# EAGLE design ZATINO V2 (EAGLE 9.6.2)
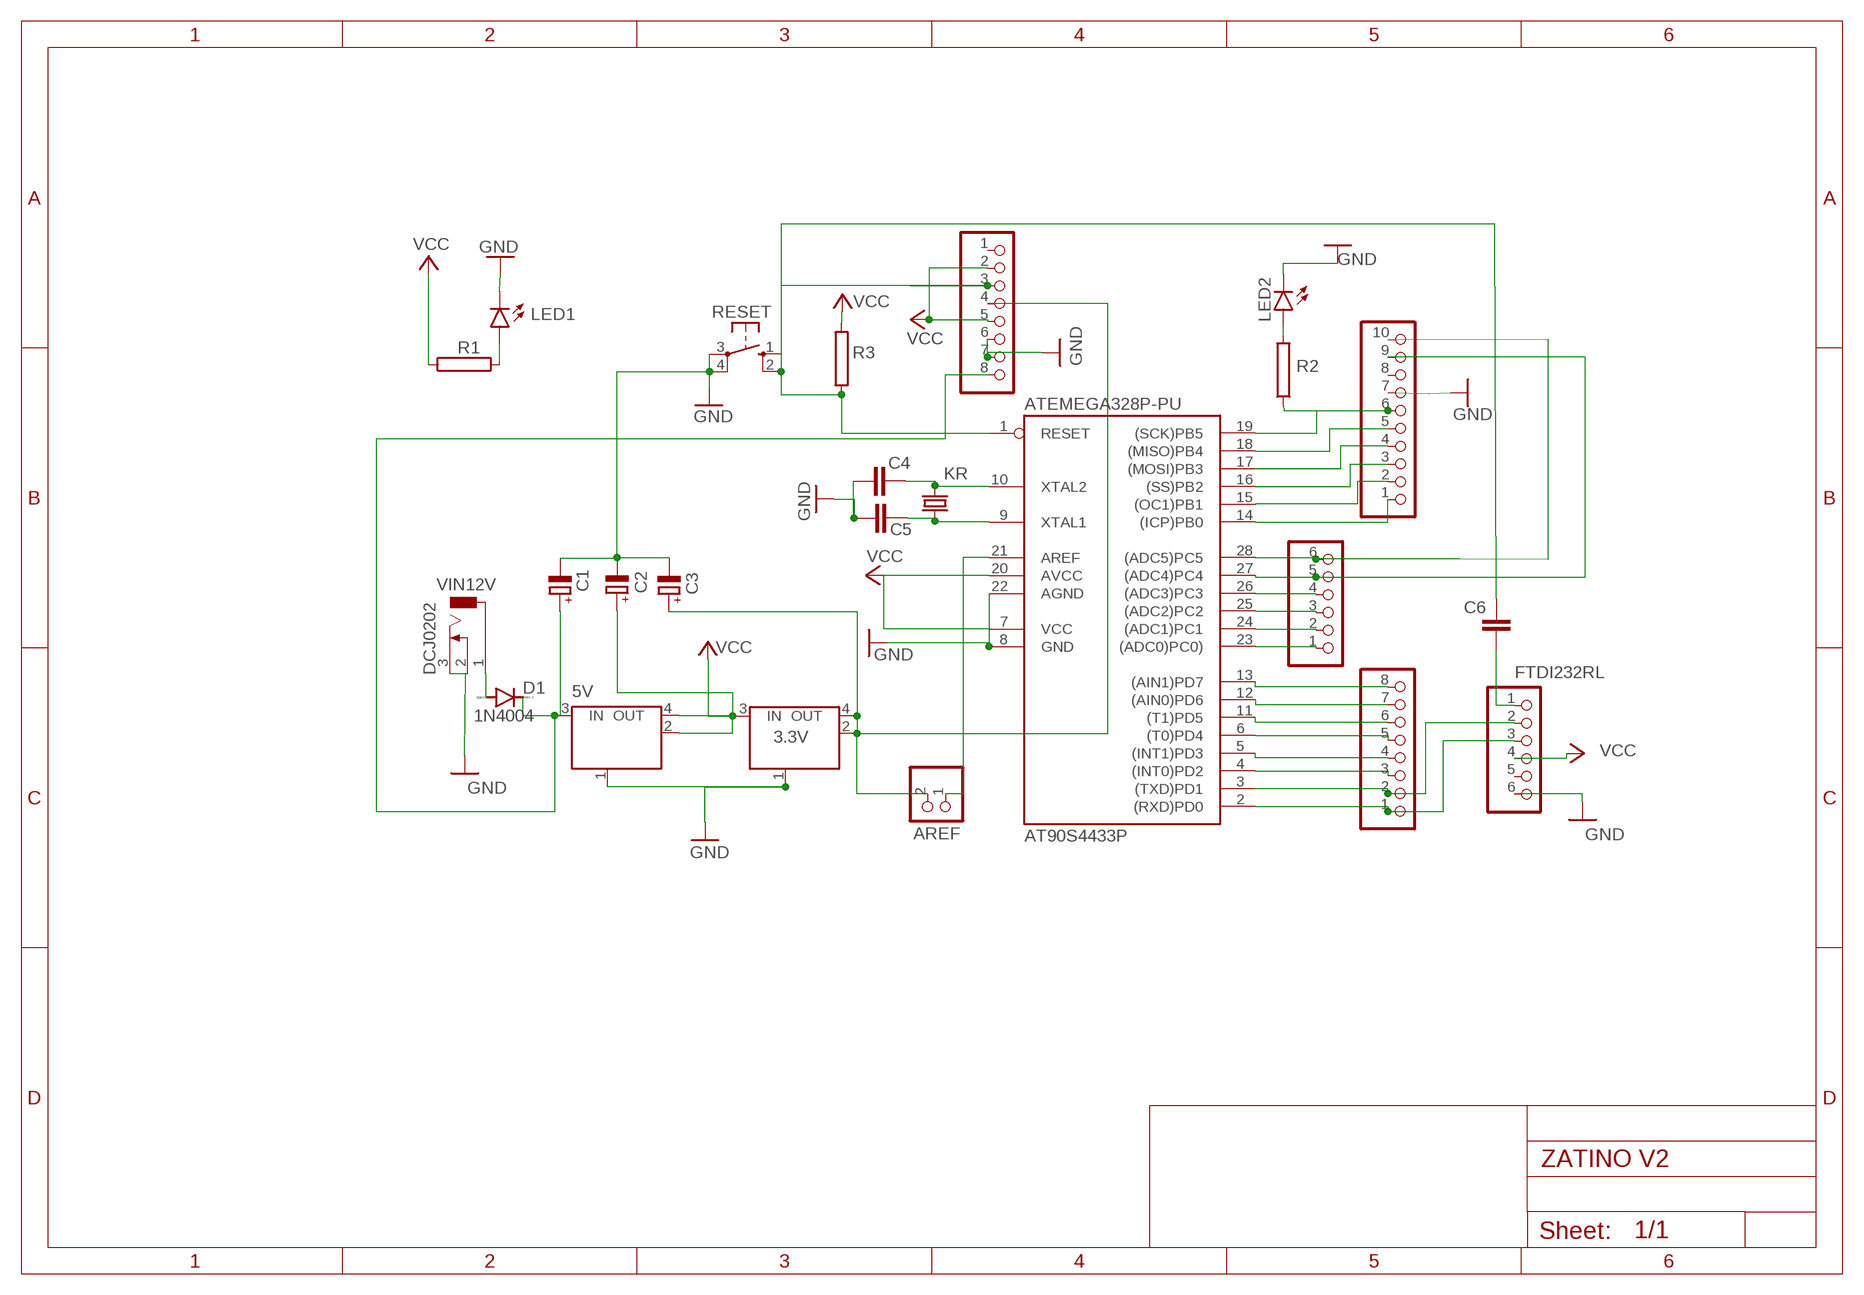
[diagram p0: schematic, sheet 1]

## Parts
3.3V  MC33269ST-3.3T3  [SOT223]
5V  MC33269ST-3.3T3  [SOT223]
AD  6x1F-H8.5  PINHD-1X6  [1X06]
ATEMEGA328P-PU  AT90S4433P  [DIL28-3]
C1  CPOL-EUE2,5-6E  [E2,5-6E]
C2  CPOL-EUE2,5-6E  [E2,5-6E]
C3  CPOL-EUE2,5-6E  [E2,5-6E]
C4  C2.5/2  [C2.5-2]
C5  C2.5/2  [C2.5-2]
C6  C2,5-3  [C2.5-3]
D1  1N4004  [DO41-10]
FTDI232RL  PINHD-1X6  [1X06]
IOH  10x1F-H8.5  PINHD-1X10_ARD  [1X10]
IOL  8x1F-H8.5  PINHD-1X8  [1X08]
JP2  PINHD-1X2  [1X02]
KR  CRYSTALHC49U-V  [HC49U-V]
LED1  LED5MM  [LED5MM]
LED2  LED5MM  [LED5MM]
POWER  8x1F-H8.5  PINHD-1X8  [1X08]
R1  RRS1/8  [RS1/8]
R2  RRS1/8  [RS1/8]
R3  RRS1/4  [RS1/4]
RESET  10-XX  [B3F-10XX]
VIN12V  DCJ0202  [DCJ0202]

## Nets
GND: 3.3V.1(GND/ADJ) 5V.1(GND/ADJ) ATEMEGA328P-PU.8(GND) ATEMEGA328P-PU.22(AGND) C1.- C2.- C3.- C4.1 C5.1 FTDI232RL.6 IOH.7 LED1.K(C) LED2.K(C) POWER.6 POWER.7 RESET.3(P) RESET.4(P1) VIN12V.2 VIN12V.3
N$1: AD.6 ATEMEGA328P-PU.28((ADC5)PC5) IOH.10
N$2: AD.5 ATEMEGA328P-PU.27((ADC4)PC4) IOH.9
N$3: AD.3 ATEMEGA328P-PU.25((ADC2)PC2)
N$4: AD.4 ATEMEGA328P-PU.26((ADC3)PC3)
N$5: AD.2 ATEMEGA328P-PU.24((ADC1)PC1)
N$6: AD.1 ATEMEGA328P-PU.23((ADC0)PC0))
N$7: ATEMEGA328P-PU.2((RXD)PD0) FTDI232RL.3 IOL.1
N$8: ATEMEGA328P-PU.3((TXD)PD1) FTDI232RL.2 IOL.2
N$9: ATEMEGA328P-PU.4((INT0)PD2) IOL.3
N$10: ATEMEGA328P-PU.5((INT1)PD3) IOL.4
N$11: ATEMEGA328P-PU.6((T0)PD4) IOL.5
N$12: ATEMEGA328P-PU.11((T1)PD5) IOL.6
N$13: ATEMEGA328P-PU.12((AIN0)PD6) IOL.7
N$14: ATEMEGA328P-PU.13((AIN1)PD7) IOL.8
N$15: ATEMEGA328P-PU.14((ICP)PB0) IOH.1
N$16: ATEMEGA328P-PU.15((OC1)PB1) IOH.2
N$17: ATEMEGA328P-PU.16((SS)PB2) IOH.3
N$18: ATEMEGA328P-PU.17((MOSI)PB3) IOH.4
N$19: ATEMEGA328P-PU.18((MISO)PB4) IOH.5
N$20: ATEMEGA328P-PU.19((SCK)PB5) IOH.6 R2.1
N$21: 5V.3(IN) C1.+ D1.C POWER.8
N$22: ATEMEGA328P-PU.10(XTAL2) C4.2 KR.2
N$23: ATEMEGA328P-PU.9(XTAL1) C5.2 KR.1
N$24: C6.1 FTDI232RL.1
N$25: 3.3V.2(OUT) 3.3V.4(OUT) C3.+ JP2.2 POWER.4
N$26: D1.A VIN12V.1
N$28: LED2.A R2.2
N$29: ATEMEGA328P-PU.1(RESET) C6.2 POWER.3 R3.1 RESET.1(S) RESET.2(S1)
N$30: ATEMEGA328P-PU.21(AREF) JP2.1
N$31: LED1.A R1.2
VCC: 3.3V.3(IN) 5V.2(OUT) 5V.4(OUT) ATEMEGA328P-PU.7(VCC) ATEMEGA328P-PU.20(AVCC) C2.+ FTDI232RL.4 POWER.2 POWER.5 R1.1 R3.2
Unconnected: FTDI232RL.5 IOH.8 POWER.1

## Notes on the sheet
- AREF

## Library data of the parts
3.3V 5V = linear:MC33269ST*: Adjustable Output Low Dropout Voltage Regulator 800 mA Source: http://www.onsemi.com/pub/Collateral/MC33269-D.PDF
AD = SmartPrj:PINHD-1X6: PIN HEADER
ATEMEGA328P-PU = atmel:AT90S4433: MICROCONTROLLER 4 Kbytes FLASH 128 bytes SRAM 256 bytes EEPROM UART 6-channel 10 bit ADC; OC_FARNELL: unknown; OC_NEWARK: unknown
C1-C3 = rcl:CPOL-EU: POLARIZED CAPACITOR, European symbol; SPICEPREFIX: C
C4-C6 = capacitor-wima:C: CAPACITOR naming: grid - package width
D1 = diode:1N4004: DIODE general purpose rectifier, 1 A
FTDI232RL = pinhead:PINHD-1X6: PIN HEADER
IOH = SmartPrj:PINHD-1X10_ARD: PIN HEADER
IOL POWER = SmartPrj:PINHD-1X8: PIN HEADER
JP2 = pinhead:PINHD-1X2: PIN HEADER
KR = crystal:CRYSTAL: CRYSTAL; OC_FARNELL: 1666969; OC_NEWARK: unknown
LED1 LED2 = led:LED: LED OSRAM: - CHIPLED LG R971, LG N971, LY N971, LG Q971, LY Q971, LO R971, LY R971 LH N974, LH R974 LS Q976, LO Q976, LY Q976 LO Q996 - Hyper CHIPLED LW Q18S LB Q993, LB Q99A, LB R99A - SideLED LS A670, LO A670, LY A670, LG A670, LP A670 LB A673, LV A673, LT A673, LW A673 LH A674 LY A675 LS A676, LA A676, LO A676, LY A676, LW A676 LS A679, LY A679, LG A679 - Hyper Micro SIDELED® LS Y876, LA Y876, LO Y876, LY Y876 LT Y87S - SmartLED LW L88C, LW L88S LB L89C, LB L89S, LG L890 LS L89K, LO L89K, LY L89K LS L896, LA L896, LO L896, LY L896 - TOPLED LS T670, LO T670, LY T670, LG T670, LP T670 LSG T670, LSP T670, LSY T670, LOP T670, LYG T670 LG T671, LOG T671, LSG T671 LB T673, LV T673, LT T673, LW T673 LH T674 LS T676, LA T676, LO T676, LY T676, LB T676, LH T676, LSB T676, LW T676 LB T67C, LV T67C, LT T67C, LS T67K, LO T67K, LY T67K, LW E67C LS E67B, LA E67B, LO E67B, LY E67B, LB E67C, LV E67C, LT E67C LW T67C LS T679, LY T679, LG T679 LS T770, LO T770, LY T770, LG T770, LP T770 LB T773, LV T773, LT T773, LW T773 LH T774 LS E675, LA E675, LY E675, LS T675 LS T776, LA T776, LO T776, LY T776, LB T776 LHGB T686 LT T68C, LB T68C - Hyper Mini TOPLED® LB M676 - Mini TOPLED Santana® LG M470 LS M47K, LO M47K, LY M47K Source: http://www.osram.convergy.de LUXEON: - LUMILED® LXK2-PW12-R00, LXK2-PW12-S00, LXK2-PW14-U00, LXK2-PW14-V00 LXK2-PM12-R00, LXK2-PM12-S00, LXK2-PM14-U00 LXK2-PE12-Q00, LXK2-PE12-R00, LXK2-PE12-S00, LXK2-PE14-T00, LXK2-PE14-U00 LXK2-PB12-K00, LXK2-PB12-L00, LXK2-PB12-M00, LXK2-PB14-N00, LXK2-PB14-P00, LXK2-PB14-Q00 LXK2-PR12-L00, LXK2-PR12-M00, LXK2-PR14-Q00, LXK2-PR14-R00 LXK2-PD12-Q00, LXK2-PD12-R00, LXK2-PD12-S00 LXK2-PH12-R00, LXK2-PH12-S00 LXK2-PL12-P00, LXK2-PL12-Q00, LXK2-PL12-R00 Source: www.luxeon.com KINGBRIGHT: KA-3528ASYC Source: www.kingbright.com
R1 R2 = resistor-power:R: Power Resitor; OC_FARNELL: unknown; OC_NEWARK: unknown
R3 = resistor-power:R: Power Resitor; MF: OHMITE; MPN: RRS1K0; OC_FARNELL: unknown; OC_NEWARK: 01F7661
RESET = switch-omron:10-XX: OMRON SWITCH; MPN: B3F-1000; OC_FARNELL: 176432; OC_NEWARK: 36M3542
VIN12V = con-jack:DCJ0202: DC POWER JACK Source: DCJ0202.pdf; OC_FARNELL: unknown; OC_NEWARK: unknown

## Net classes
0 default: width 0.254 mm, clearance 0.254 mm
1 power: width 0.61 mm, drill 0.61 mm, clearance 0.254 mm
2 gnd: width 0.305 mm, drill 0.559 mm, clearance 0.254 mm
3 usbvcc: width 0.508 mm, drill 0.61 mm, clearance 0.254 mm
4 aref: width 0.406 mm, drill 0.61 mm, clearance 0.254 mm

## Board
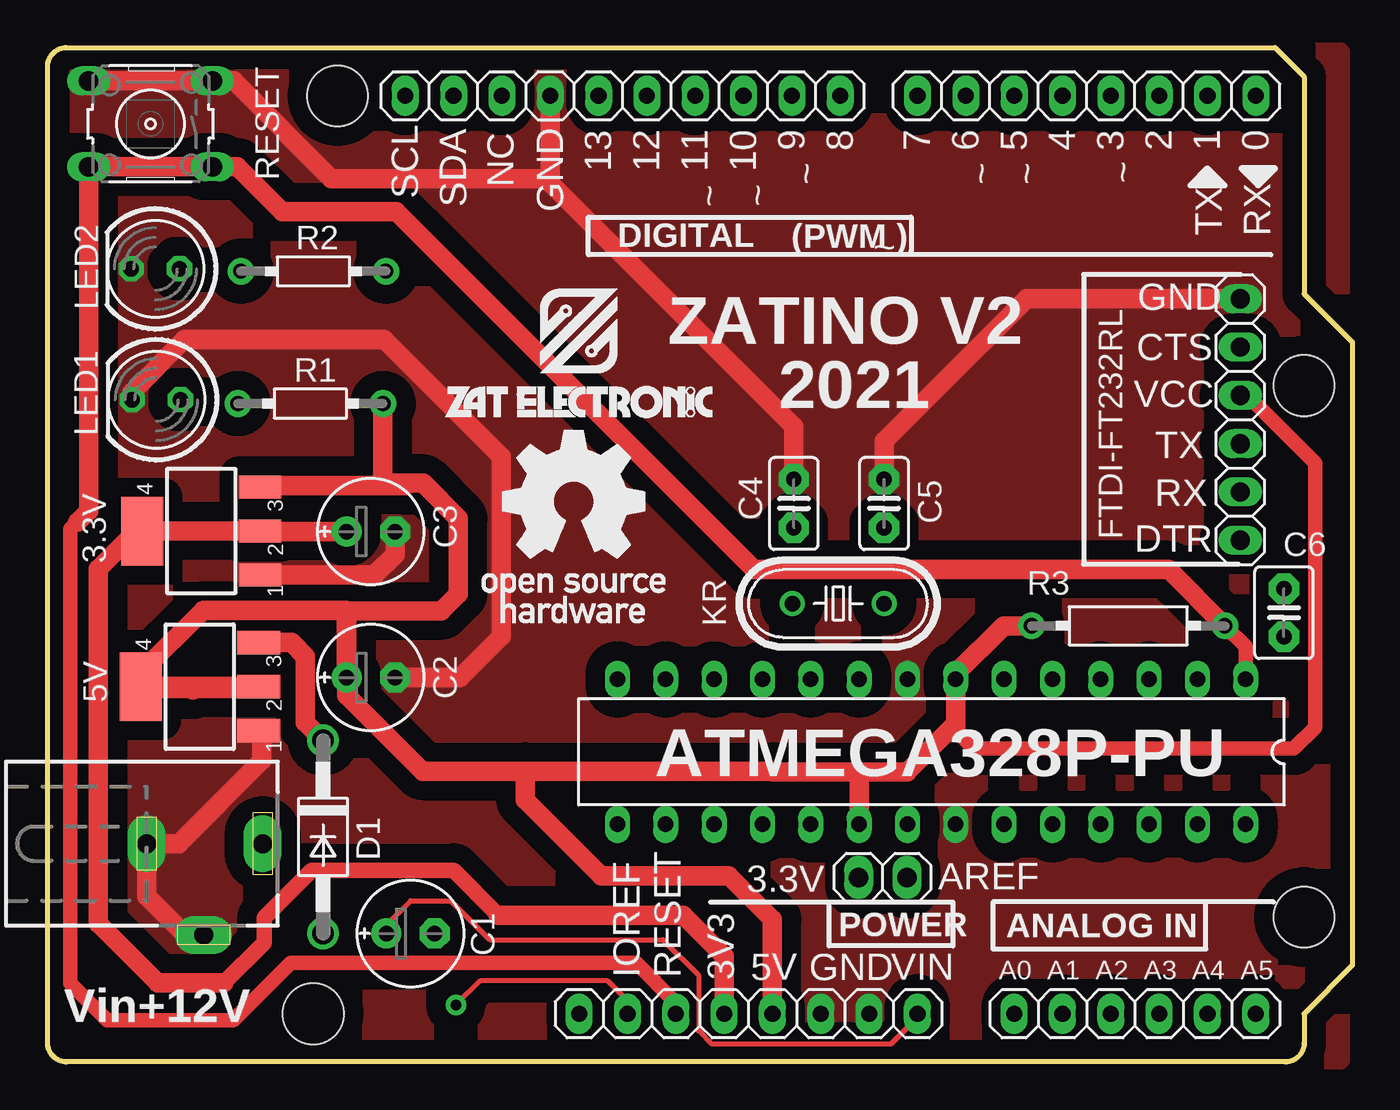
[diagram p1: board, top side]
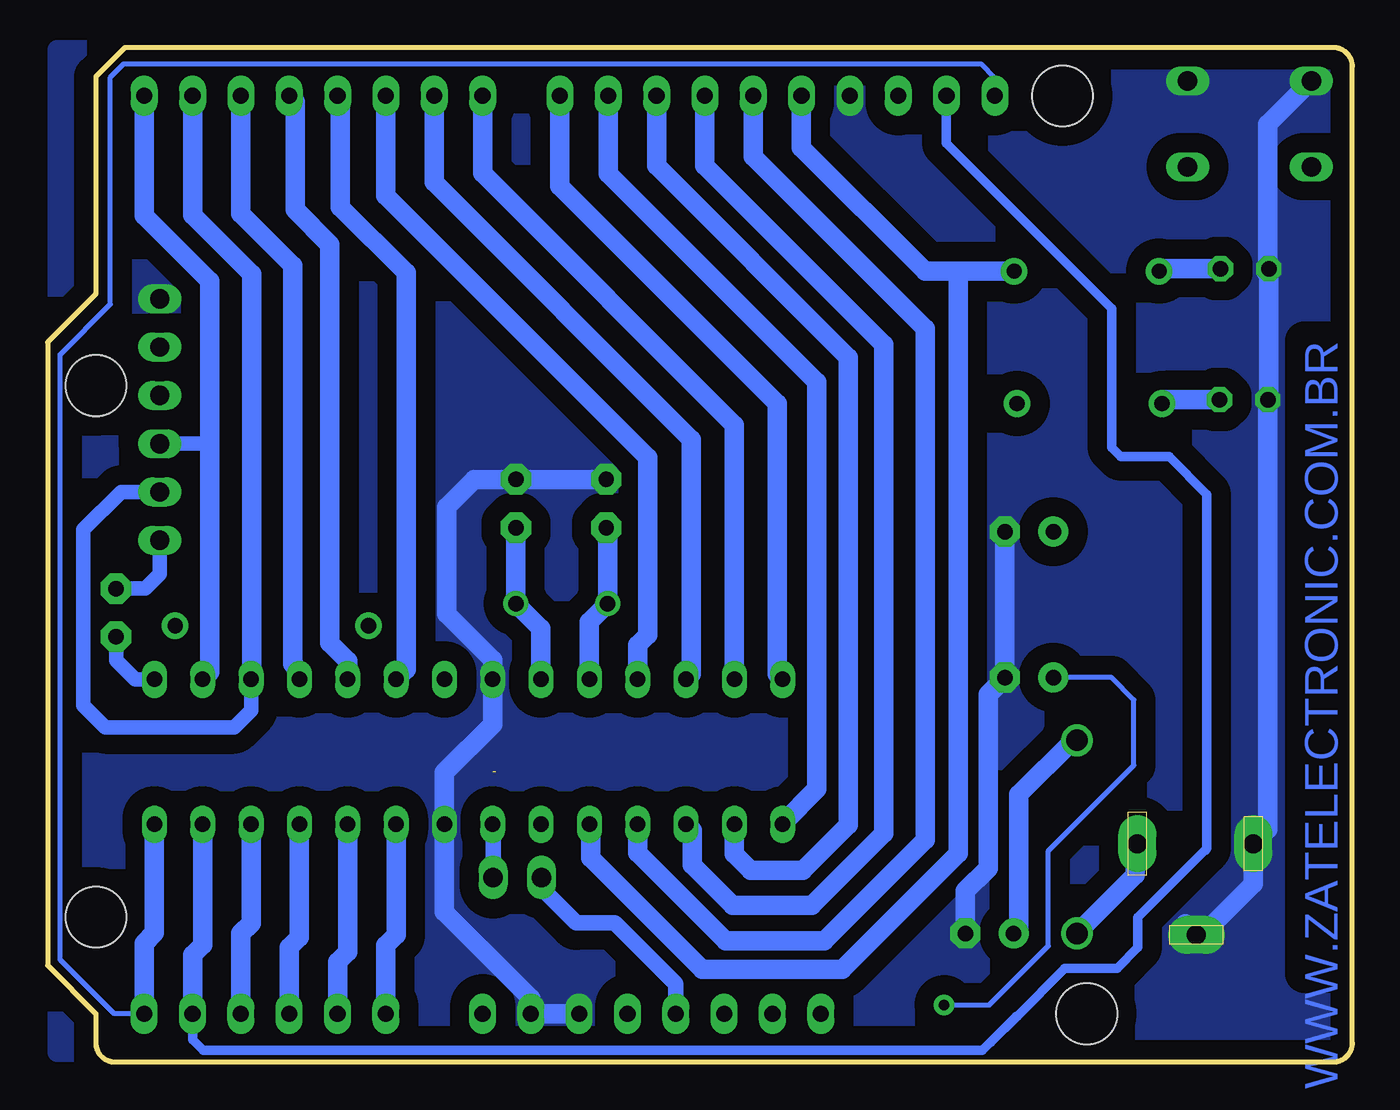
[diagram p2: board, bottom side, seen from below]

Size 68.58 x 53.34 mm. Coordinates in mm from the lower left corner, seen from the top.
Outline: 64.52,53.34 66.04,51.82 66.04,40.39 68.58,37.85 68.58,5.08 66.04,2.54 66.04,1 arc-90 65.04,0 1,0 arc-90 0,1 0,52.34 arc-90 1,53.34 64.52,53.34
Copper layers (1*16): Top 0.035mm / dielectric 1.5mm / Bottom 0.035mm
Design rules "default *": minimum track width 20mil, minimum drill 22mil, track to track 1mil, track to pad 1mil, pad to pad 1mil, via to via 1mil, smd to smd 1mil, copper to edge 1mil, drill to drill 1mil, minimum pad ring 10mil, minimum via ring 10mil, stop-mask expansion 1mil, vias tented up to drill 30mil, thermal gap 1mil
Holes 3.2 mm at 66.04,35.56 66.04,7.62 15.24,50.8 13.97,2.54

### Footprints (pad centres in the part's own frame; a part is rotated, then mirrored left to right if it is on the bottom)
SOT223 = smd 1.219 x 2.235: 1 -2.311,-3.099; 2 0,-3.099; 3 2.311,-3.099 | smd 3.6 x 2.2: 4 0,3.099
1X06 = drill 0.85 pad 1.422 long: 1 -6.35,0; 2 -3.81,0; 3 -1.27,0; 4 1.27,0; 5 3.81,0; 6 6.35,0
DIL28-3 = drill 0.813 long: 1 -16.51,-3.81; 2 -13.97,-3.81; 3 -11.43,-3.81; 4 -8.89,-3.81; 5 -6.35,-3.81; 6 -3.81,-3.81; 7 -1.27,-3.81; 8 1.27,-3.81; 9 3.81,-3.81; 10 6.35,-3.81; 11 8.89,-3.81; 12 11.43,-3.81; 13 13.97,-3.81; 14 16.51,-3.81; 15 16.51,3.81; 16 13.97,3.81; 17 11.43,3.81; 18 8.89,3.81; 19 6.35,3.81; 20 3.81,3.81; 21 1.27,3.81; 22 -1.27,3.81; 23 -3.81,3.81; 24 -6.35,3.81; 25 -8.89,3.81; 26 -11.43,3.81; 27 -13.97,3.81; 28 -16.51,3.81
E2,5-6E = drill 0.813 pad 1.575: + -1.27,0 | drill 0.813 pad 1.575 octagon: - 1.27,0
C2.5-2 = drill 0.813 pad 1.6 octagon: 1 -1.27,0; 2 1.27,0
C2.5-3 = drill 0.813 pad 1.6 octagon: 1 -1.27,0; 2 1.27,0
DO41-10 = drill 1.118: A 5.08,0; C -5.08,0
1X06' = drill 1.016 long: 1 -6.35,0; 2 -3.81,0; 3 -1.27,0; 4 1.27,0; 5 3.81,0; 6 6.35,0
1X10 = drill 0.85 pad 1.422 long: 1 -11.43,0; 2 -8.89,0; 3 -6.35,0; 4 -3.81,0; 5 -1.27,0; 6 1.27,0; 7 3.81,0; 8 6.35,0; 9 8.89,0; 10 11.43,0
1X08 = drill 0.85 pad 1.422 long: 1 -8.89,0; 2 -6.35,0; 3 -3.81,0; 4 -1.27,0; 5 1.27,0; 6 3.81,0; 7 6.35,0; 8 8.89,0
1X02 = drill 1.016 long: 1 -1.27,0; 2 1.27,0
HC49U-V = drill 0.813: 1 -2.413,0; 2 2.413,0
LED5MM = drill 0.813 octagon: A -1.27,0; K 1.27,0
RS1/8 = drill 0.8 pad 1.4: 1 -3.81,0; 2 3.81,0
RS1/4 = drill 0.8 pad 1.4: 1 -5.08,0; 2 5.08,0
B3F-10XX = drill 1.016 long: 1 -3.251,2.261; 2 3.251,2.261; 3 -3.251,-2.261; 4 3.251,-2.261
DCJ0202 = drill 1 pad 2 long: 1 0,3.1; 2 4.8,0; 3 0,-3

### Placement (x,y rotation side)
3.3V  8.08,27.91 90 top
5V  8,19.74 90 top
AD  57.15,2.54 0 top
ATEMEGA328P-PU  46.46,16.31 180 top
C1  19.08,6.76 0 top
C2  16.99,20.22 0 top
C3  16.99,27.89 0 top
C4  39.22,29.36 270 top
C5  43.97,29.36 270 top
C6  64.97,23.62 270 top
D1  14.48,11.84 270 top
FTDI232RL  [1X06']  62.69,33.78 90 top
IOH  30.23,50.8 180 top
IOL  54.61,50.8 180 top
JP2  43.89,9.7 180 top
KR  41.55,24.1 180 top
LED1  5.71,34.82 180 top
LED2  5.66,41.71 180 top
POWER  36.83,2.54 0 top
R1  13.82,34.62 180 top
R2  13.97,41.58 180 top
R3  56.79,22.94 180 top
RESET  5.41,49.33 180 top
U$1  [LOGO_OPENHARDWARE_3]  22.38,23.09 0 top
U$3  [LOGO_ESCRITA_MEDIO]  20.68,33.63 0 top
VIN12V  8.2,11.48 270 top

### Tracks (layer width: path | path; a pad name or v marks a point on that pad's centre or on a via)
GND
  Top 0.762: 62.36,40.13 FTDI232RL.6
  Top 1.016: C4.1 39.22,33.4 26.42,46.2 IOH.7 26.42,46.46 14.91,46.46 9.78,51.59 RESET.3 RESET.4 2.41,51.59 2.16,51.33 | VIN12V.2 7.24,6.68 5.2,8.71 VIN12V.3 6.88,11.48 11.25,15.85 11.25,17.27 5V.1 | 3.3V.1 17.17,25.6 18.26,26.7 C3.- | C5.1 43.97,32.64 51.46,40.13 62.36,40.13 | C2.- 21.69,20.22 23.85,22.38 23.85,31.83 17.7,37.97 7.19,37.97 4.45,35.23 LED1.K
  Bottom 1.016: C4.1 C5.1 46.15,30.63 47.6,29.18 47.6,23.55 45.19,21.13 ATEMEGA328P-PU.8 45.19,17.75 47.73,15.21 ATEMEGA328P-PU.22 47.73,7.9 43.18,3.35 POWER.7 POWER.6 | LED2.K 4.47,41.71 | LED1.K 4.5,34.77 | LED2.K 4.55,41.55 | LED1.K 4.55,34.92 | 8.79,7.26 VIN12V.2 | C1.- 20.34,8.99 19.15,10.19 19.15,19.33 C2.- C3.- | RESET.4 4.45,49.3 4.45,41.76 LED2.K | LED2.K 4.39,34.87 LED1.K | LED1.K 4.45,12.24 VIN12V.3 5.2,9.38 7.39,7.19
  pour Bottom (isolate 1.016, no thermals): 0.38,53.21 0.38,0.51 68.07,0.51 68.07,53.21
  pour Top (isolate 1.016, no thermals): 0.25,53.09 0.25,0.13 67.94,0.13 67.94,53.09
N$1
  Bottom 0.254: AD.6 65.08,2.54 67.92,5.38 67.92,37.2 65.28,39.84 65.28,51.78 64.58,52.48 19.53,52.48 18.8,51.74 IOH.10
  Bottom 1.016: ATEMEGA328P-PU.28 62.97,6.78 63.5,6.25 AD.6
N$2
  Bottom 0.254: 7.64,11.23 7.64,11.02 | 15.11,4.93 15.14,4.9 | 19.13,0.91 19,1.04
  Bottom 0.508: IOH.9 21.34,48.31 12.65,39.62 12.65,32.31 12.17,31.83 9.63,31.83 7.64,29.84 7.64,11.23 11.28,7.59 11.28,6.02 12.37,4.93 15.11,4.93 | 15.14,4.9 17.63,2.41 | 17.63,2.41 19,1.04 | 17.63,2.41 17.66,2.41 19.46,0.61 60.41,0.61 60.96,1.16 AD.5
  Bottom 1.016: ATEMEGA328P-PU.27 60.43,6.17 60.96,5.64 AD.5
N$3
  Bottom 1.016: AD.3 55.88,6.02 55.35,6.55 ATEMEGA328P-PU.25
N$4
  Bottom 1.016: AD.4 58.42,6.76 57.89,7.29 ATEMEGA328P-PU.26
N$5
  Bottom 1.016: ATEMEGA328P-PU.24 52.81,5.79 53.34,5.26 AD.2
N$6
  Bottom 1.016: AD.1 50.8,6.15 50.27,6.68 ATEMEGA328P-PU.23
N$7
  Bottom 0.762: FTDI232RL.3 60.05,32.51
  Bottom 1.016: IOL.1 63.5,44.5 60.05,41.05 60.05,33.2 60.05,32.51 60.05,20.5 ATEMEGA328P-PU.2
N$8
  Bottom 0.762: FTDI232RL.2 64.72,29.97 66.7,27.99 66.7,18.75 65.56,17.6 58.78,17.6 57.89,18.49 ATEMEGA328P-PU.3
  Bottom 1.016: ATEMEGA328P-PU.3 57.86,20.14 57.86,41.43 60.96,44.53 IOL.2
N$9
  Bottom 1.016: ATEMEGA328P-PU.4 55.35,20.57 55.7,20.93 55.7,41.88 58.42,44.6 IOL.3
N$10
  Bottom 1.016: ATEMEGA328P-PU.5 52.81,21.08 53.75,22.02 53.75,42.98 55.58,44.81 55.58,50.49 IOL.4
N$11
  Bottom 1.016: ATEMEGA328P-PU.6 49.73,20.65 49.73,41.5 53.19,44.96 53.19,50.65 IOL.5
N$12
  Bottom 1.016: ATEMEGA328P-PU.11 37.57,21.92 37.03,22.45 37.03,31.77 50.8,45.54 IOL.6
N$13
  Bottom 1.016: IOL.7 48.26,46.25 34.75,32.74 34.75,20.4 ATEMEGA328P-PU.12
N$14
  Bottom 1.016: IOL.8 45.72,46.74 32.49,33.5 ATEMEGA328P-PU.13
N$15
  Bottom 1.016: ATEMEGA328P-PU.14 30.23,20.4 30.23,34.62 41.66,46.05 IOH.1
N$16
  Bottom 1.016: IOH.2 39.12,46.71 28.14,35.74 28.14,14.35 29.95,12.55 ATEMEGA328P-PU.15
N$17
  Bottom 1.016: IOH.3 36.58,47.12 26.49,37.03 26.49,12.47 28.88,10.08 31.62,10.08 32.49,10.95 ATEMEGA328P-PU.16
N$18
  Bottom 1.016: IOH.4 34.04,47.12 24.64,37.72 24.64,12.01 28.42,8.23 32.56,8.23 34.7,10.36 34.7,12.17 ATEMEGA328P-PU.17
N$19
  Bottom 1.016: IOH.5 31.5,47.6 22.45,38.56 22.45,11.68 27.76,6.38 32.94,6.38 37.57,11 ATEMEGA328P-PU.18
N$20
  Bottom 0.762: 20.73,41.45 20.6,41.45 17.91,41.45 R2.1
  Bottom 1.016: ATEMEGA328P-PU.19 40.03,12.42 40.03,10.74 34.16,4.88 26.82,4.88 20.73,10.97 20.73,41.45 | 20.65,41.5 20.6,41.45 | IOH.6 28.96,48.08 22.45,41.58 R2.1
N$21
  Top 0.254: C1.+ 17.8,7.21 19.07,8.48 21.18,8.48 23.24,6.43 32.33,6.43 34.21,4.55 34.21,1.63 34.88,0.96 44.35,0.96 45.67,2.29 45.67,2.49 POWER.8
  Top 1.016: D1.C 13.54,17.86 13.54,21.34 12.83,22.05 5V.3
  Bottom 1.016: C1.+ 17.53,7.04 17.53,14.07 14.68,16.92 D1.C
N$22
  Bottom 1.016: C4.2 39.14,28.02 KR.2 40.11,23.14 ATEMEGA328P-PU.10
N$23
  Bottom 1.016: C5.2 KR.1 42.65,22.78 ATEMEGA328P-PU.9
N$24
  Bottom 0.762: FTDI232RL.1 62.69,25.65 63.45,24.89 C6.1
N$25
  Top 0.813: 9.27,4.17 11.38,6.27 11.38,7.57 13.89,10.08 21.34,10.08 23.7,7.72
  Top 1.016: C3.+ 11.2,27.89 3.3V.2 | 9.27,4.17 5.79,4.17 2.67,7.29 2.67,25.93 4.65,27.91 3.3V.4 3.3V.2 | 3.3V.2 5.66,27.91 5.46,27.71 | POWER.4 35.56,5.56 33.4,7.72 23.7,7.72
  Bottom 0.813: 35.56,3.35 POWER.4 35.56,4.12 38.76,7.32 40.79,7.32 42.62,9.14 JP2.2
N$26
  Bottom 1.016: VIN12V.1 11.3,11.56 11.4,11.66 11.4,9.83 D1.A
N$28
  Bottom 1.016: LED2.A 10.03,41.71 R2.2
N$29
  Top 0.762: POWER.3 33.02,3.12 30.94,5.21 12.78,5.21 9.75,2.18 3.15,2.18 1.19,4.14 1.19,28.02 1.57,28.4 | ATEMEGA328P-PU.1 62.97,21.84 R3.1
  Top 1.016: 1.57,28.4 2.16,28.98 RESET.2 RESET.1 9.98,47.07 12.34,44.7 18.31,44.7 37.13,25.88 58.93,25.88 R3.1
  Bottom 0.762: C6.2 64.97,21.11 63.98,20.12 ATEMEGA328P-PU.1
N$30
  Bottom 0.813: JP2.1 45.16,12.47 ATEMEGA328P-PU.21
N$31
  Bottom 1.016: LED1.A 9.8,34.82 R1.2
VCC  (via drill 0.56)  (1 unrouted)
  Top 0.254: POWER.2 30.48,3.23 29.44,4.27 22.73,4.27 v21.46,3
  Top 0.762: FTDI232RL.4 63.07,35.05 66.62,31.5 66.62,17.6 65.51,16.48 48.67,16.48 47.73,17.42
  Top 1.016: 47.73,17.8 ATEMEGA328P-PU.7 47.73,20.42 50.24,22.94 R3.2 | 47.73,17.8 47.73,17.42 | 45.19,15.27 47.73,17.8 | 7.62,19.56 7.8,19.74 5V.2 5V.4 | 10.72,19.63 5,19.63 5V.4 | 45.03,15.27 42.72,15.27 | 42.72,15.27 38.15,15.27 38.15,15.29 25.09,15.29 | C2.+ 15.7,20.24 15.7,23.72 | 15.7,23.72 15.7,23.75 8.18,23.75 4.9,20.47 5V.4 | C2.+ 15.72,19.28 19.71,15.29 25.09,15.29 | 15.72,23.5 C2.+ | 15.7,23.72 20.7,23.72 21.59,24.61 21.59,28.57 19.74,30.43 18.67,30.43 | 3.3V.3 11.25,30.3 18.8,30.3 18.67,30.43 | 18.67,30.43 17.86,30.43 17.63,30.66 R1.1 | 25.09,15.29 25.09,13.79 29.11,9.78 35.81,9.78 38.1,7.49 POWER.5 | ATEMEGA328P-PU.20 42.65,15.19 42.72,15.27
  Bottom 0.254: C2.+ 12.65,20.22 11.48,19.05 11.48,15.6 15.97,11.1 15.97,6.1 19.07,3 v21.46,3

### Text on the board
Bottom: WWW.ZATELECTRONIC.COM.BR
tPlace: 13 | 12 | 11 | 10 | 9 | 8 | 7 | 6 | 5 | 4 | 3 | 2 | 1 | 0 | ~ | ~ | ~ | ~ | ~ | ~ | DIGITAL | (PWM ) | ~ | GND | CTS | VCC | TX | RX | FTDI-FT232RL | DTR | POWER | ANALOG IN
tNames: SCL | SDA | NC | GND | TX | RX | ZATINO V2 | 2021 | ATMEGA328P-PU | 3.3V | AREF | IOREF | RESET | 3V3 | 5V | GND | VIN | A0 | A1 | A2 | A3 | A4 | A5 | Vin+12V
214bmp: D:/SmartProjects/Snc/a4_bn_logo2.bmp